# EAGLE design Laser_Control_Board (EAGLE 9.5.2)
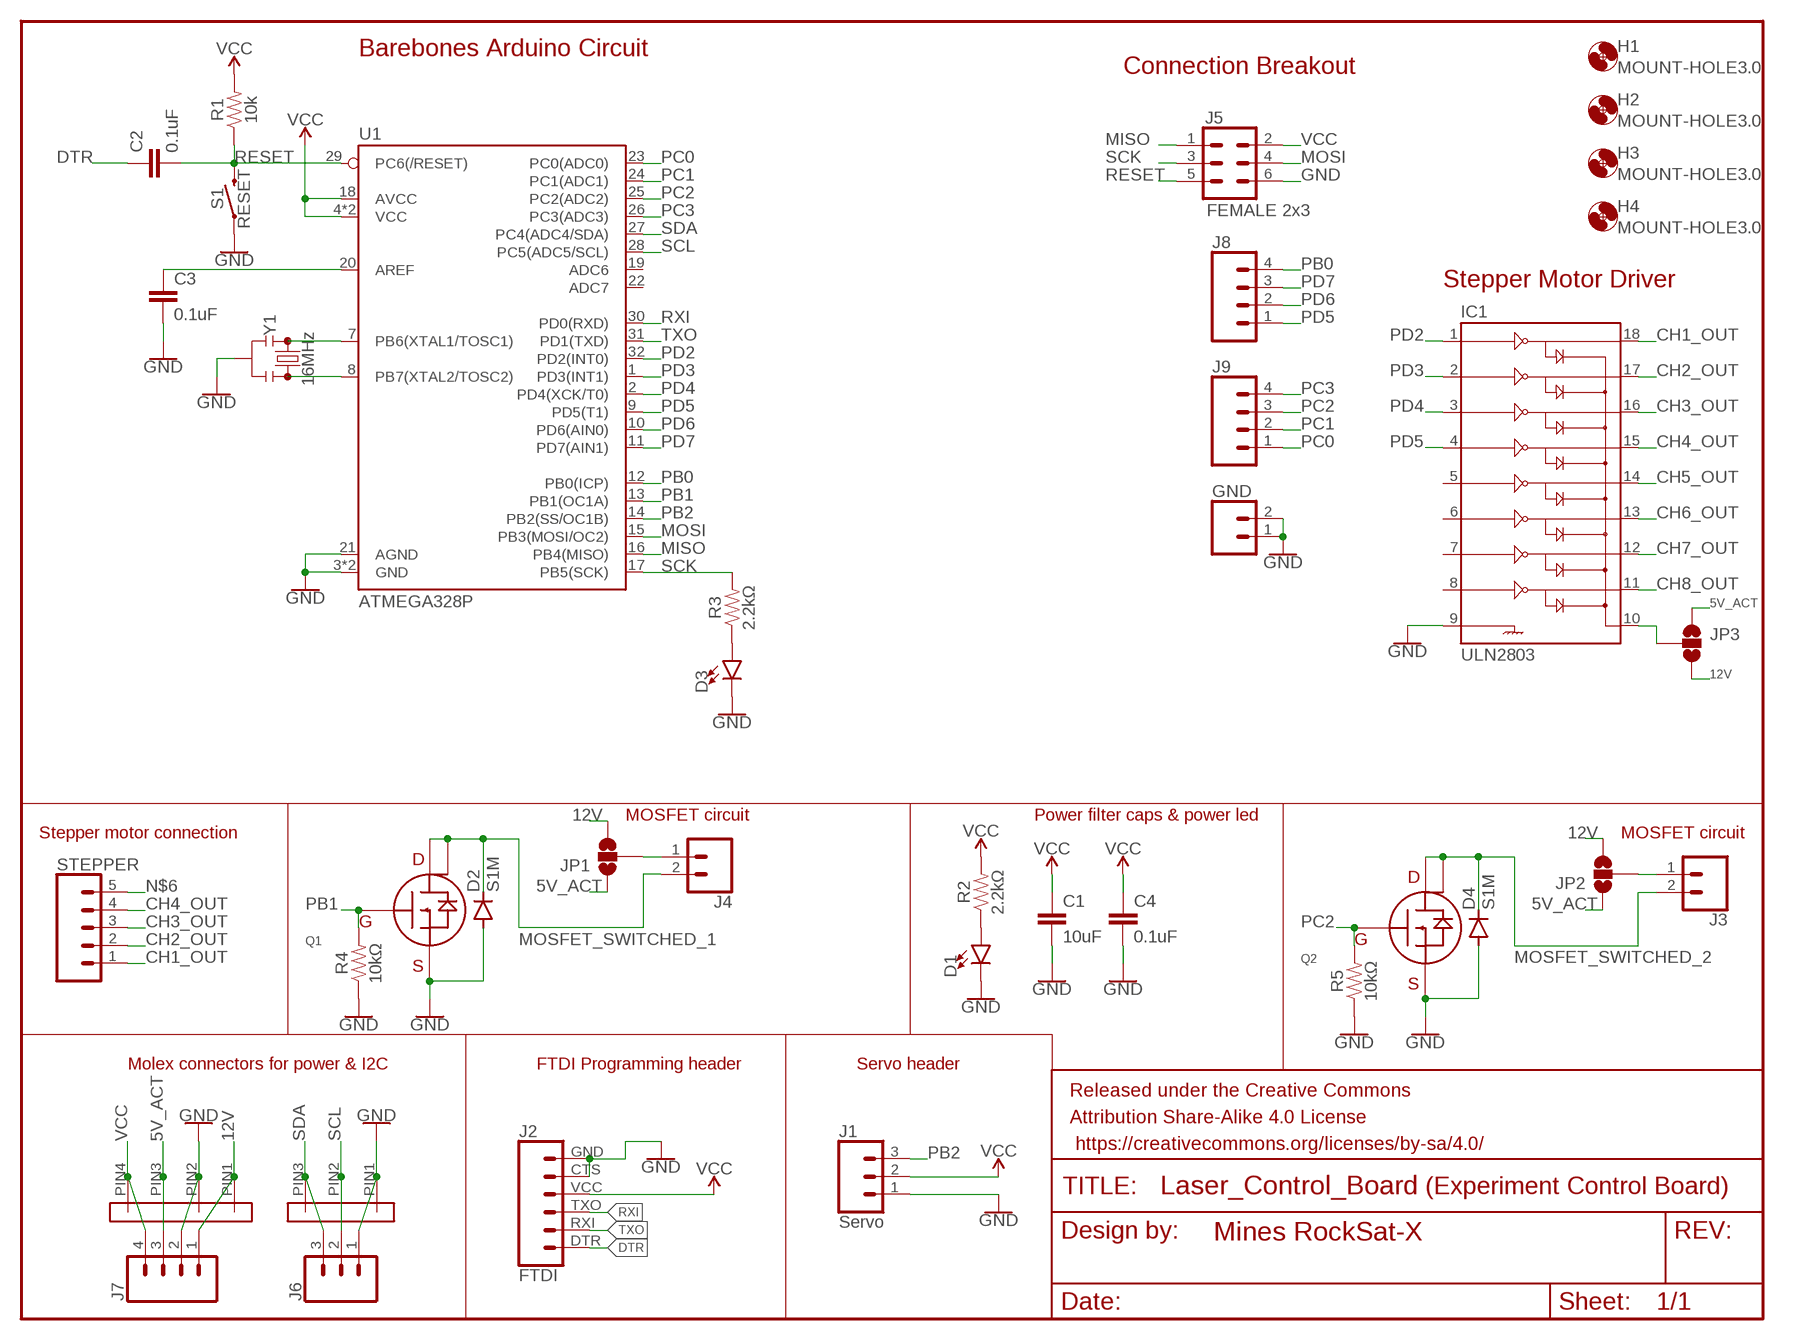
[diagram p0: schematic, sheet 1]

## Parts
C1  10uF  10UF-0805-10V-10%  [0805]
C2  0.1uF  2.2UF-0805-25V-(+80/-20%)  [0805]
C3  0.1uF  2.2UF-0805-25V-(+80/-20%)  [0805]
C4  0.1uF  2.2UF-0805-25V-(+80/-20%)  [0805]
D1  LED-GREEN1206  [LED-1206]
D2  S1M  [SMA]
D3  LED-GREEN1206  [LED-1206]
D4  S1M  [SMA]
FRAME1  FRAME-LETTERNO_PACKAGE  [DUMMY]
GND  CONN_02LOCK_LONGPADS  [1X02_LOCK_LONGPADS]
H1  MOUNT-HOLE3.0  [3,0]
H2  MOUNT-HOLE3.0  [3,0]
H3  MOUNT-HOLE3.0  [3,0]
H4  MOUNT-HOLE3.0  [3,0]
IC1  ULN2803  ULN2803SOICW  [SO18L]
J1  Servo  CONN_03  [1X03]
J2  FTDI  6_PIN_SERIAL_CABLEPTH  [FTDI_BASIC]
J3  CONN_02  [1X02]
J4  CONN_02  [1X02]
J5  FEMALE 2x3  CONN_03X2FEMALE  [2X3]
J6  CONN_03  [1X03]
J7  CONN_04LOCK  [1X04_LOCK]
J8  CONN_04LOCK  [1X04_LOCK]
J9  CONN_04LOCK  [1X04_LOCK]
JP1  JUMPER-SMT_3_NO_NO_SILK  [SMT-JUMPER_3_0-NO_TRACE_NO-SILK]
JP2  JUMPER-SMT_3_NO_NO_SILK  [SMT-JUMPER_3_0-NO_TRACE_NO-SILK]
JP3  JUMPER-SMT_3_NO_NO_SILK  [SMT-JUMPER_3_0-NO_TRACE_NO-SILK]
Q1  BUK9880-55A  [SOT223]
Q2  BUK9880-55A  [SOT223]
R1  10k  RESISTOR0805  [0805]
R2  2.2kΩ  RESISTOR0805  [0805]
R3  2.2kΩ  RESISTOR0805  [0805]
R4  10kΩ  RESISTOR0805  [0805]
R5  10kΩ  RESISTOR0805  [0805]
S1  RESET  MOMENTARY-SWITCH-SPST-SMD-5.2-REDUNDANT  [TACTILE_SWITCH_SMD_5.2MM]
STEPPER  CONN_05  [1X05]
U1  ATMEGA328P  ATMEGA328P_TQFP  [TQFP32-08]
U$1  MOLEX_4PIN  [MOLEX_4PIN]
U$2  MOLEX_3PIN  [MOLEX_3PIN]
Y1  16MHz  RESONATOR-16MHZSMD_3.2X1.3  [RESONATOR-SMD-3.2X1.3]

## Nets
5V_ACT: J7.3 JP1.1 JP2.1 JP3.1 U$1.PIN3
12V: J7.1 JP1.3 JP2.3 JP3.3 U$1.PIN1
CH1_OUT: IC1.18 STEPPER.1
CH2_OUT: IC1.17 STEPPER.2
CH3_OUT: IC1.16 STEPPER.3
CH4_OUT: IC1.15 STEPPER.4
CH5_OUT: IC1.14
CH6_OUT: IC1.13
CH7_OUT: IC1.12
CH8_OUT: IC1.11
DTR: C2.1 J2.DTR
GND: C1.2 C3.2 C4.2 D1.C D2.A D3.C D4.A GND.1 GND.2 IC1.9 J1.1 J2.CTS J2.GND J5.6 J6.1 J7.2 Q1.3(SOURCE) Q2.3(SOURCE) R4.1 R5.1 S1.1 S1.2 U1.3(GND) U1.5(GND) U1.21(AGND) U$1.PIN2 U$2.PIN1 Y1.2
MISO: J5.1 U1.16(PB4(MISO))
MOSFET_SWITCHED_1: D2.C J4.2 Q1.2(DRAIN) Q1.4(DRAIN_TAB)
MOSFET_SWITCHED_2: D4.C J3.2 Q2.2(DRAIN) Q2.4(DRAIN_TAB)
MOSI: J5.4 U1.15(PB3(MOSI/OC2))
N$1: J4.1 JP1.2
N$2: U1.7(PB6(XTAL1/TOSC1)) Y1.1
N$3: U1.8(PB7(XTAL2/TOSC2)) Y1.3
N$4: C3.1 U1.20(AREF)
N$5: D1.A R2.1
N$6: IC1.10 JP3.2 STEPPER.5
N$7: D3.A R3.1
N$8: J3.1 JP2.2
PB0: J8.4 U1.12(PB0(ICP))
PB1: Q1.1(GATE) R4.2 U1.13(PB1(OC1A))
PB2: J1.3 U1.14(PB2(SS/OC1B))
PC0: J9.1 U1.23(PC0(ADC0))
PC1: J9.2 U1.24(PC1(ADC1))
PC2: J9.3 Q2.1(GATE) R5.2 U1.25(PC2(ADC2))
PC3: J9.4 U1.26(PC3(ADC3))
PD2: IC1.1 U1.32(PD2(INT0))
PD3: IC1.2 U1.1(PD3(INT1))
PD4: IC1.3 U1.2(PD4(XCK/T0))
PD5: IC1.4 J8.1 U1.9(PD5(T1))
PD6: J8.2 U1.10(PD6(AIN0))
PD7: J8.3 U1.11(PD7(AIN1))
RESET: C2.2 J5.5 R1.1 S1.3 S1.4 U1.29(PC6(/RESET))
RXI: J2.TXO U1.30(PD0(RXD))
SCK: J5.3 R3.2 U1.17(PB5(SCK))
SCL: J6.2 U1.28(PC5(ADC5/SCL)) U$2.PIN2
SDA: J6.3 U1.27(PC4(ADC4/SDA)) U$2.PIN3
TXO: J2.RXI U1.31(PD1(TXD))
VCC: C1.1 C4.1 J1.2 J2.VCC J5.2 J7.4 R1.2 R2.2 U1.4(VCC) U1.6(VCC) U1.18(AVCC) U$1.PIN4
Unconnected: IC1.5 IC1.6 IC1.7 IC1.8 U1.19(ADC6) U1.22(ADC7)

## Notes on the sheet
- Barebones Arduino Circuit
- Connection Breakout
- Stepper Motor Driver
- MOSFET circuit | Power filter caps & power led
- Stepper motor connection | MOSFET circuit
- Molex connectors for power & I2C | FTDI Programming header | Servo header
- (Experiment Control Board)

## Library data of the parts
C1 = SparkFun-Capacitors:10UF: 10.0µF ceramic capacitors A capacitor is a passive two-terminal electrical component used to store electrical energy temporarily in an electric field.; PROD_ID: CAP-11330
C2-C4 = SparkFun-Capacitors:2.2UF: 2.2µF ceramic capacitors A capacitor is a passive two-terminal electrical component used to store electrical energy temporarily in an electric field.; PROD_ID: CAP-11624; VALUE: 2.2uF
D1 D3 = SparkFun-LED:LED-GREEN: Green SMD LED Used in manufacturing of various products at SparkFun Packages: 0603 - SMD 0603 package [Product Link] <http://www.futureelectronics.com/en/technologies/semiconductors/optoelectronics/leds/Pages/9894312-LTST-C190GKT.aspx?CrossPart=HSMG-C190&IM=0> LilyPad 1206 - SMD1206 LilyPad package [Product Link] <http://www.futureelectronics.com/en/Technologies/Product.aspx?ProductID=IN150NGHARVATEKCORPORATION2049943&IM=0> 1206 - SMD1206 package [Product Link] <http://www.futureelectronics.com/en/technologies/semiconductors/optoelectronics/leds/Pages/8315665-LTST-C150KGKT.aspx?IM=0> 1206 Bottom Mount -SMD 1206 Bottom Mount [Product Link] <http://www.digikey.com/product-detail/en/lite-on-inc/LTST-C230KGKT/160-1456-1-ND/386854> SparkFun Products: Pro Mini 328 -5V <https://www.sparkfun.com/products/821> RedBoard <https://www.sparkfun.com/products/12757> MP3 Trigger <https://www.sparkfun.com/products/13720> Makey Makey <https://www.sparkfun.com/products/11076>; PROD_ID: DIO-00862; VALUE: GREEN
D2 D4 = diode:S1M
FRAME1 = SparkFun-Aesthetics:FRAME-LETTER: Schematic Frame - Letter Standard 8.5x11 US Letter frame; DESIGNER: Mines RockSat-X; VERSION: 1
GND J3 J4 = SparkFun-Connectors:CONN_02: Multi connection point. Often used as Generic Header-pin footprint for 0.1 inch spaced/style header connections On any of the 0.1 inch spaced packages, you can populate with these: Break Away Headers - Straight <https://www.sparkfun.com/products/116> (PRT-00116) Break Away Male Headers - Right Angle <https://www.sparkfun.com/products/553> (PRT-00553) Female Headers <https://www.sparkfun.com/products/115> (PRT-00115) Break Away Headers - Machine Pin <https://www.sparkfun.com/products/117> (PRT-00117) Break Away Female Headers - Swiss Machine Pin <https://www.sparkfun.com/products/743> (PRT-00743) For SCREWTERMINALS and SPRING TERMINALS visit here: Screw Terimnals on SparkFun.com <https://www.sparkfun.com/search/results?term=Screw+Terminals> (5mm/3.5mm/2.54mm spacing) This device is also useful as a general connection point to wire up your design to another part of your project. Our various solder wires solder well into these plated through hole pads. Hook-Up Wire - Assortment (Stranded, 22 AWG) <https://www.sparkfun.com/products/11375> (PRT-11375) Hook-Up Wire - Assortment (Solid Core, 22 AWG) <https://www.sparkfun.com/products/11367> (PRT-11367) View the entire wire category on our website here <https://www.sparkfun.com/categories/141> Special notes: Molex polarized connector foot print use with: PRT-08233 with associated crimp pins and housings. 2.54_SCREWTERM for use with PRT-10571. 3.5mm Screw Terminal footprints for PRT-08084 5mm Screw Terminal footprints for use with PRT-08432
H1-H4 = holes:MOUNT-HOLE: MOUNTING HOLE with drill center marker
IC1 = SparkFun-IC-Special-Function:ULN2803: Darlington Driver(IC-07959, low stock) ULN2803 Darlington array. 500mA max per channel, 8-channel package. Spark Fun Electronics SKU : COM-00312
J1 J6 = SparkFun-Connectors:CONN_03: Multi connection point. Often used as Generic Header-pin footprint for 0.1 inch spaced/style header connections On any of the 0.1 inch spaced packages, you can populate with these: Break Away Headers - Straight <https://www.sparkfun.com/products/116> (PRT-00116) Break Away Male Headers - Right Angle <https://www.sparkfun.com/products/553> (PRT-00553) Female Headers <https://www.sparkfun.com/products/115> (PRT-00115) Break Away Headers - Machine Pin <https://www.sparkfun.com/products/117> (PRT-00117) Break Away Female Headers - Swiss Machine Pin <https://www.sparkfun.com/products/743> (PRT-00743) Stackable Header - 3 Pin (Female, 0.1") <https://www.sparkfun.com/products/13875> (PRT-13875) For SCREWTERMINALS and SPRING TERMINALS visit here: Screw Terimnals on SparkFun.com <https://www.sparkfun.com/search/results?term=Screw+Terminals> (5mm/3.5mm/2.54mm spacing) This device is also useful as a general connection point to wire up your design to another part of your project. Our various solder wires solder well into these plated through hole pads. Hook-Up Wire - Assortment (Stranded, 22 AWG) <https://www.sparkfun.com/products/11375> (PRT-11375) Hook-Up Wire - Assortment (Solid Core, 22 AWG) <https://www.sparkfun.com/products/11367> (PRT-11367) View the entire wire category on our website here <https://www.sparkfun.com/categories/141> Special notes: Molex polarized connector foot print use with SKU : PRT-08232 with associated crimp pins and housings.; PROD_ID: XXX-00000; VALUE: 455-1750-1-ND
J2 = SparkFun-Connectors:6_PIN_SERIAL_CABLE: 6-pin header connection for use with the "FTDI BASIC" pinout - CABLE SIDE. Also known as "Arduino Serial Program Header". This is used on a design to provide a 6-pin connection point for serial communication usually from a USB cable (D+/D-) to these headers (RX/TX). It also has the remaining pins necessary for programming in the Arduino evironment (DTR, GND, and sometimes VCC). Note, this device has "CABLE" in the name. It is intended to be used on a design that usually lives on the end of your USB cable and prvides the converter chip (FTDI232 or FTDI231x) to commnicate serial RX/TX. The "sister" device, named "TARGET" is inteneded to be used on a design that contains a target micro-controller that you wish to program. You can populate with some of these: Female Headers <https://www.sparkfun.com/products/115> (PRT-00115) For reference (or to suit your programming needs) check out these designs: SparkFun FTDI Basic Breakout - 5V <https://www.sparkfun.com/products/9716> (DEV-09716) SparkFun FTDI Basic Breakout - 3.3V <https://www.sparkfun.com/products/9873> (DEV-09873) SparkFun FTDI SmartBasic <https://www.sparkfun.com/products/12935> (DEV-12935) SparkFun Beefy 3 - FTDI Basic Breakout <https://www.sparkfun.com/products/13746> (DEV-13746)
J5 = SparkFun-Connectors:CONN_03X2: Multi connection point. Often used as Generic Header-pin footprint for 0.1 inch spaced/style header connections You can populate with any combo of single row headers, but if you'd like an exact match, check these: Header - 2x3 (Male, 0.1") <https://www.sparkfun.com/products/12807> (PRT-12807) Header - 2x3 (Female, 0.1") <https://www.sparkfun.com/products/13010> (PRT-13010) 2x3 Pin Shrouded Header <https://www.sparkfun.com/products/10877> (PRT-10877) On any of the 0.1 inch spaced packages, you can populate with these: Break Away Headers - Straight <https://www.sparkfun.com/products/116> (PRT-00116) Break Away Male Headers - Right Angle <https://www.sparkfun.com/products/553> (PRT-00553) Female Headers <https://www.sparkfun.com/products/115> (PRT-00115) Break Away Headers - Machine Pin <https://www.sparkfun.com/products/117> (PRT-00117) Break Away Female Headers - Swiss Machine Pin <https://www.sparkfun.com/products/743> (PRT-00743) Special note: the shrouded connector mates well with our 3x2 ribbon cables: Ribbon Crimp Connector - 6-pin (2x3, Female) <https://www.sparkfun.com/products/10651> (PRT-10651) Ribbon Cable - 6 wire (15ft) <https://www.sparkfun.com/products/10646> (PRT-10646); PROD_ID: CONN-11566
J7-J9 = SparkFun-Connectors:CONN_04: Multi connection point. Often used as Generic Header-pin footprint for 0.1 inch spaced/style header connections On any of the 0.1 inch spaced packages, you can populate with these: Break Away Headers - Straight <https://www.sparkfun.com/products/116> (PRT-00116) Break Away Male Headers - Right Angle <https://www.sparkfun.com/products/553> (PRT-00553) Female Headers <https://www.sparkfun.com/products/115> (PRT-00115) Break Away Headers - Machine Pin <https://www.sparkfun.com/products/117> (PRT-00117) Break Away Female Headers - Swiss Machine Pin <https://www.sparkfun.com/products/743> (PRT-00743) For SCREWTERMINALS and SPRING TERMINALS visit here: Screw Terimnals on SparkFun.com <https://www.sparkfun.com/search/results?term=Screw+Terminals> (5mm/3.5mm/2.54mm spacing) This device is also useful as a general connection point to wire up your design to another part of your project. Our various solder wires solder well into these plated through hole pads. Hook-Up Wire - Assortment (Stranded, 22 AWG) <https://www.sparkfun.com/products/11375> (PRT-11375) Hook-Up Wire - Assortment (Solid Core, 22 AWG) <https://www.sparkfun.com/products/11367> (PRT-11367) View the entire wire category on our website here <https://www.sparkfun.com/categories/141> Special notes: Molex polarized connector foot print use with SKU : PRT-08231 with associated crimp pins and housings. 1MM SMD Version SKU: PRT-10208; PROD_ID: CONN-09696
JP1-JP3 = SparkFun-Jumpers:JUMPER-SMT_3_NO: Normally open jumper This jumper has three pads in close proximity to each other. Apply solder to close the connection(s).
Q1 Q2 = PowerManagementParts:BUK9880-55A
R1-R5 = SparkFun-Resistors:RESISTOR: Generic Resistor Package
S1 = SparkFun-Switches:MOMENTARY-SWITCH-SPST: Momentary Switch (Pushbutton) - SPST Normally-open (NO) SPST momentary switches (buttons, pushbuttons). Variants PTH-12MM - 12mm square, through-hole Momentary Pushbutton Switch - 12mm Square <https://www.sparkfun.com/products/9190> (COM-09190) PTH-6.0MM, PTH-6.0MM-KIT - 6.0mm square, through-hole Mini Pushbutton Switch <https://www.sparkfun.com/products/97> (COM-00097) KIT package intended for soldering kit's - only one side of pads' copper is exposed. PTH-RIGHT-ANGLE-KIT - Right-angle, through-hole Right Angle Tactile Button <https://www.sparkfun.com/products/10791> - Used on SparkFun BigTime Watch Kit <https://www.sparkfun.com/products/11734> SMD-12MM - 12mm square, surface-mount Tactile Button - SMD (12mm) <https://www.sparkfun.com/products/12993> (COM-12993) Used on SparkFun PicoBoard <https://www.sparkfun.com/products/11888> SMD-4.5MM - 4.5mm Square Trackball Switch Used on SparkFun Blackberry Trackballer Breakout <https://www.sparkfun.com/products/13169> SMD-4.6MMX2.8MM - 4.60mm x 2.80mm, surface mount Used on SparkFun SAMD21 Mini Breakout <https://www.sparkfun.com/products/13664> SMD-5.2MM, SMD-5.2-REDUNDANT - 5.2mm square, surface-mount Mini Pushbutton Switch - SMD <https://www.sparkfun.com/products/8720> (COM-08720) Used on Arduino Pro Mini <https://www.sparkfun.com/products/11114> REDUNDANT package connects both switch circuits together SMD-6.0X3.5MM - 6.0 x 3.5mm, surface mount Momentary Reset Switch SMD <https://www.sparkfun.com/products/8229> (COM-08229) SMD-6.2MM-TALL - 6.2mm square, surface mount Tactile Button - SMD (6mm) <https://www.sparkfun.com/products/12992> Used on SparkFun Digital Sandbox <https://www.sparkfun.com/products/12651> SMD-RIGHT-ANGLE - Right-angle, surface mount Used on SparkFun Block for Intel® Edison - Arduino <https://www.sparkfun.com/products/13036>; PROD_ID: SWCH-08247; SF_SKU: COM-08720
STEPPER = SparkFun-Connectors:CONN_05: Multi connection point. Often used as Generic Header-pin footprint for 0.1 inch spaced/style header connections On any of the 0.1 inch spaced packages, you can populate with these: Break Away Headers - Straight <https://www.sparkfun.com/products/116> (PRT-00116) Break Away Male Headers - Right Angle <https://www.sparkfun.com/products/553> (PRT-00553) Female Headers <https://www.sparkfun.com/products/115> (PRT-00115) Break Away Headers - Machine Pin <https://www.sparkfun.com/products/117> (PRT-00117) Break Away Female Headers - Swiss Machine Pin <https://www.sparkfun.com/products/743> (PRT-00743) For SCREWTERMINALS and SPRING TERMINALS visit here: Screw Terimnals on SparkFun.com <https://www.sparkfun.com/search/results?term=Screw+Terminals> (5mm/3.5mm/2.54mm spacing) This device is also useful as a general connection point to wire up your design to another part of your project. Our various solder wires solder well into these plated through hole pads. Hook-Up Wire - Assortment (Stranded, 22 AWG) <https://www.sparkfun.com/products/11375> (PRT-11375) Hook-Up Wire - Assortment (Solid Core, 22 AWG) <https://www.sparkfun.com/products/11367> (PRT-11367) View the entire wire category on our website here <https://www.sparkfun.com/categories/141> Special notes: Molex polarized connector foot print use with SKU : PRT-08231 with associated crimp pins and housings. 1MM SMD Version SKU: PRT-10208
U1 = SparkFun-IC-Microcontroller:ATMEGA328P_TQFP: Popular 328P in QFP Storefront component: ATmega328 - TQFP <https://www.sparkfun.com/products/13448> (COM-13448) Datasheet <http://www.sparkfun.com/datasheets/Components/SMD/ATMega328.pdf> SparkFun Products SparkFun RedBoard - Programmed with Arduino <https://www.sparkfun.com/products/12757> (DEV-12757) Arduino Pro Mini 328 - 5V/16MHz <https://www.sparkfun.com/products/11113> (DEV-11113) Arduino Pro Mini 328 - 3.3V/8MHz <https://www.sparkfun.com/products/11114> (DEV-11114) SparkFun OpenLog <https://www.sparkfun.com/products/13712> (DEV-13712) SparkFun MicroView - OLED Arduino Module <https://www.sparkfun.com/products/12923> (DEV-12923) SparkFun Digital Sandbox <https://www.sparkfun.com/products/12651> (DEV-12651) SparkFun PicoBoard <https://www.sparkfun.com/products/11888> (WIG-11888) Arduino Fio <https://www.sparkfun.com/products/10116> (DEV-10116) LilyPad Arduino 328 Main Board <https://www.sparkfun.com/products/13342> (DEV-13342) SparkFun RedStick <https://www.sparkfun.com/products/13741> (DEV-13741) LilyPad MP3 <https://www.sparkfun.com/products/11013> (DEV-11013) LilyPad Arduino SimpleSnap <https://www.sparkfun.com/products/10941> (DEV-10941) SparkFun Stepoko <https://www.sparkfun.com/products/13899> (ROB-13899) SparkFun Geiger Counter <https://www.sparkfun.com/products/11345> (SEN-11345) SparkFun EL Sequencer <https://www.sparkfun.com/products/12781> (COM-12781) Arduino Pro 328 - 5V/16MHz <https://www.sparkfun.com/products/10915> (DEV-10915) CryptoCape <https://www.sparkfun.com/products/12773> (DEV-12773) SparkFun IR Thermometer Evaluation Board - MLX90614 <https://www.sparkfun.com/products/10740> (SEN-10740) SparkFun RedBot Mainboard <https://www.sparkfun.com/products/12097> (ROB-12097) Arduino Pro 328 - 3.3V/8MHz <https://www.sparkfun.com/products/10914> (DEV-10914) SparkFun Block for Intel® Edison - Arduino <https://www.sparkfun.com/products/13036> (DEV-13036) SparkFun Simon Says - Surface Mount Soldering Kit <https://www.sparkfun.com/products/10935> (KIT-10935) SparkFun 7-Segment Serial Display - Red <https://www.sparkfun.com/products/11441> (COM-11441) SparkFun 7-Segment Serial Display - White <https://www.sparkfun.com/products/11629> (COM-11629) SparkFun 7-Segment Serial Display - Yellow <https://www.sparkfun.com/products/11443> (COM-11443) SparkFun 7-Segment Serial Display - Kelly Green <https://www.sparkfun.com/products/11440> (COM-11440) SparkFun 7-Segment Serial Display - Blue <https://www.sparkfun.com/products/11442> (COM-11442) SparkFun OpenSegment Serial Display - 20mm (Blue) <https://www.sparkfun.com/products/11647> (COM-11647) SparkFun OpenSegment Serial Display - 20mm (Green) <https://www.sparkfun.com/products/11646> (COM-11646) SparkFun OpenSegment Serial Display - 20mm (White) <https://www.sparkfun.com/products/11648> (COM-11648) SparkFun OpenSegment Serial Display - 20mm (Red) <https://www.sparkfun.com/products/11644> (COM-11644) SparkFun OpenSegment Serial Display - 20mm (Yellow) <https://www.sparkfun.com/products/11645> (COM-11645) SparkFun OpenSegment Shield <https://www.sparkfun.com/products/13190> (DEV-13190); PROD_ID: IC-09069; VALUE: ATMEGA328P_TQFP
U$1 = PowerManagementParts:MOLEX_4PIN
U$2 = PowerManagementParts:MOLEX_3PIN
Y1 = SparkFun-Clocks:RESONATOR-16MHZ: 16MHz Resonator Digikey Example <http://www.digikey.com/product-detail/en/murata-electronics-north-america/CSTCE16M0V53-R0/490-1198-1-ND/584635> Frequency: 16MHz Frequency Stability: ±0.3% Frequency Tolerance: ±0.5% Capacitance: 15pF SparkFun Products SparkFun OpenLog <https://www.sparkfun.com/products/13712> SparkFun MicroView - OLED Arduino Module <https://www.sparkfun.com/products/12923>; PROD_ID: XTAL-08900

## Board
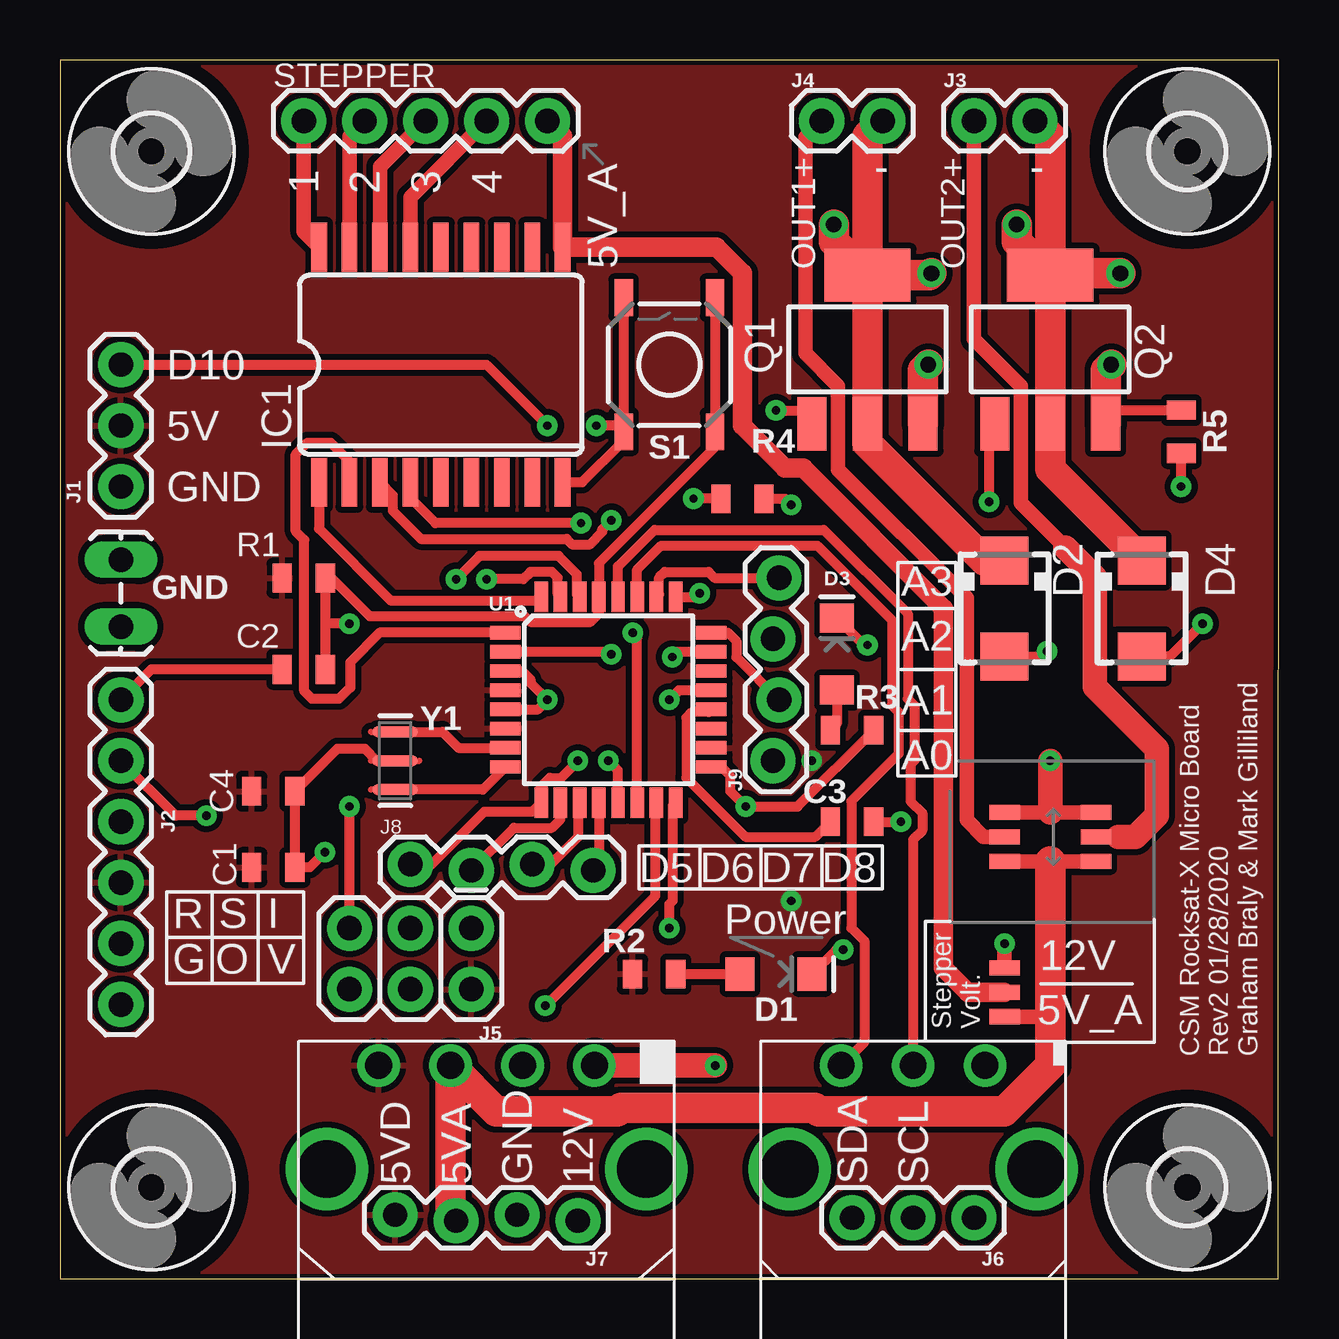
[diagram p1: board, top side]
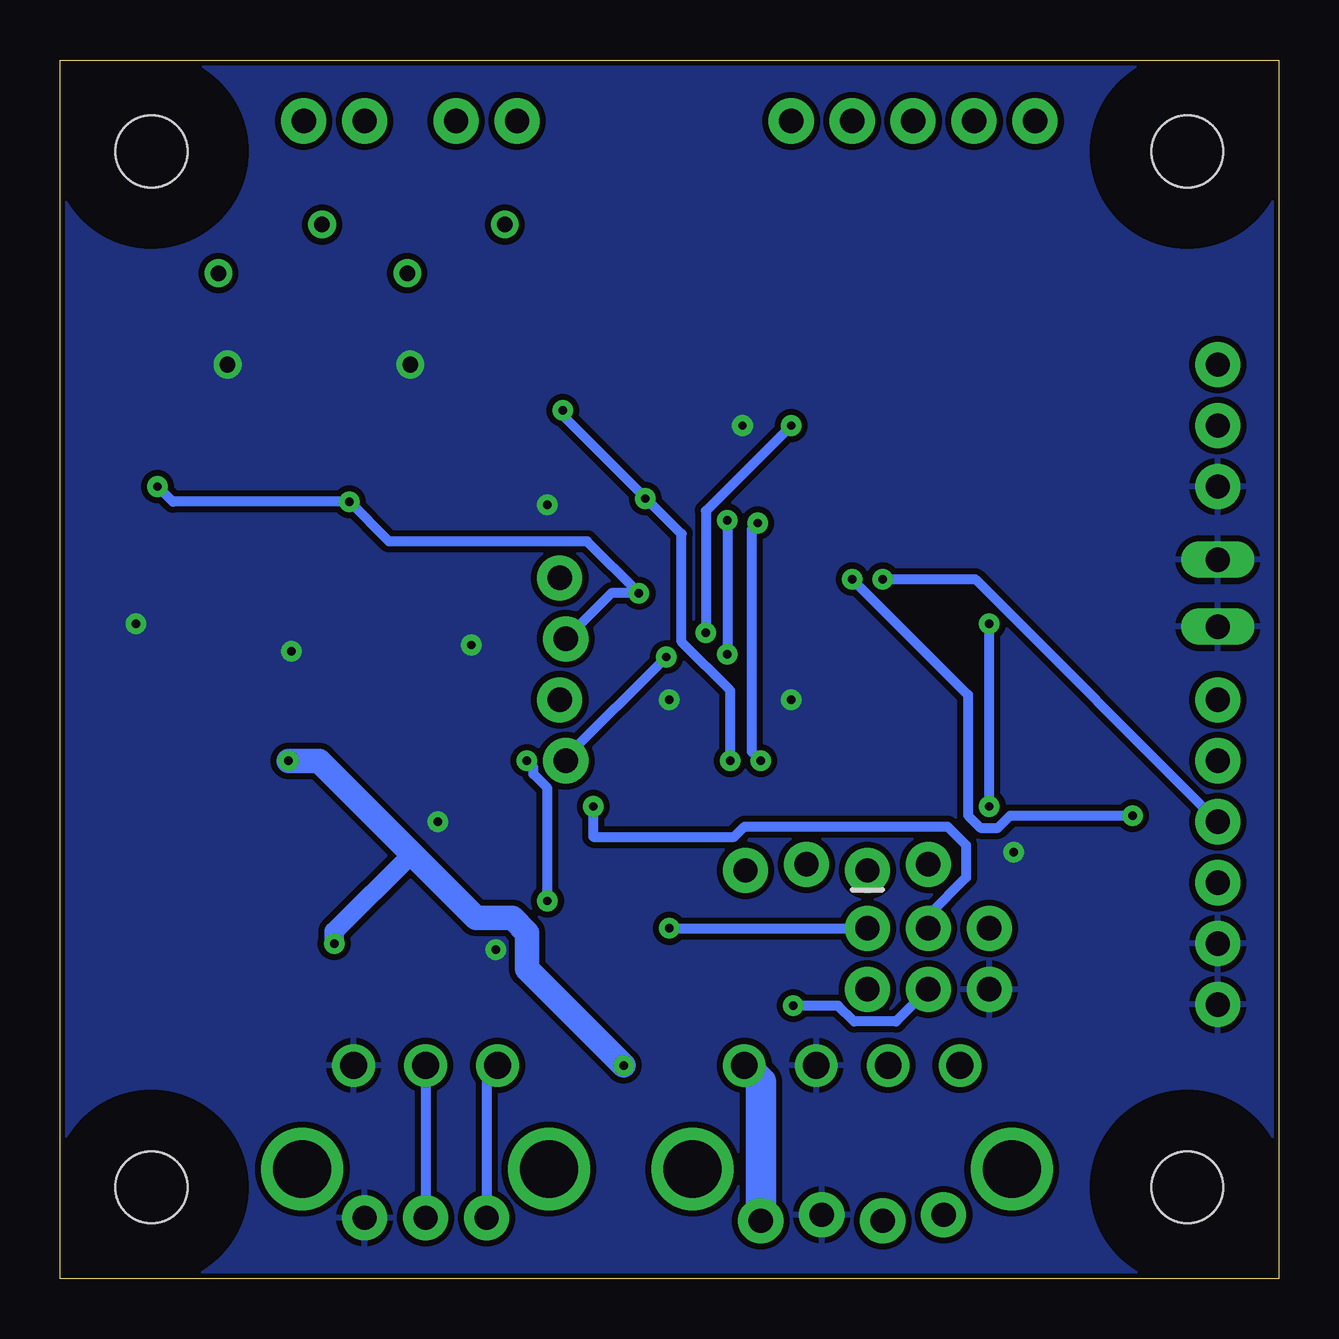
[diagram p2: board, bottom side, seen from below]

Size 50.8 x 50.8 mm. Coordinates in mm from the lower left corner, seen from the top.
Outline: 0,0 50.78,0 50.8,50.8 0,50.8 0,0
Copper layers (1*16): Top 0.035mm / dielectric 1.5mm / Bottom 0.035mm
Design rules "SparkFun-2-layer-STANDARD_13milDrill": minimum track width 10mil, minimum drill 13mil, track to track 10mil, track to pad 8mil, pad to pad 8mil, via to via 10mil, smd to smd 8mil, copper to edge 8mil, drill to drill 8mil, minimum pad ring 10mil, minimum via ring 10mil, stop-mask expansion 4mil, vias tented up to drill 25mil, thermal gap 10mil

### Footprints (pad centres in the part's own frame; a part is rotated, then mirrored left to right if it is on the bottom)
0805 = smd 0.8 x 1.2: 1 -0.9,0; 2 0.9,0
LED-1206 = smd 1.2 x 1.4: A -1.5,0; C 1.5,0
SMA = smd 2 x 2: A 2,0; C -2,0
1X02_LOCK_LONGPADS = drill 1.016 long: 1 -0.127,0; 2 2.667,0
3,0 = hole 3: 0,0
SO18L = smd 0.66 x 2.032: 1 -0.635,-4.902; 2 0.635,-4.902; 3 1.905,-4.902; 4 3.175,-4.902; 5 4.445,-4.902; 6 5.715,-4.902; 7 6.985,-4.902; 8 8.255,-4.902; 9 9.525,-4.902; 10 9.525,4.902; 11 8.255,4.902; 12 6.985,4.902; 13 5.715,4.902; 14 4.445,4.902; 15 3.175,4.902; 16 1.905,4.902; 17 0.635,4.902; 18 -0.635,4.902
1X03 = drill 1.016 pad 1.88: 1 0,0; 2 2.54,0; 3 5.08,0
FTDI_BASIC = drill 1.016 pad 1.88: CTS 10.16,0; DTR 0,0; GND 12.7,0; RXI 2.54,0; TXO 5.08,0; VCC 7.62,0
1X02 = drill 1.016 pad 1.88: 1 0,0; 2 2.54,0
2X3 = drill 1.016 pad 1.88: 1 0,0; 2 0,2.54; 3 2.54,0; 4 2.54,2.54; 5 5.08,0; 6 5.08,2.54
1X04_LOCK = drill 1.016 pad 1.88: 1 0,0.127; 2 2.54,-0.127; 3 5.08,0.127; 4 7.62,-0.127
SMT-JUMPER_3_0-NO_TRACE_NO-SILK = smd 0.635 x 1.27: 1 -1.016,0; 2 0,0; 3 1.016,0
SOT223 = smd 1.219 x 2.235: 1 -2.311,-3.099; 2 0,-3.099; 3 2.311,-3.099 | smd 3.6 x 2.2: 4 0,3.099
TACTILE_SWITCH_SMD_5.2MM = smd 1.524 x 0.762: 1 -2.794,1.905; 2 2.794,1.905; 3 -2.794,-1.905; 4 2.794,-1.905
1X05 = drill 1.016 pad 1.88: 1 0,0; 2 2.54,0; 3 5.08,0; 4 7.62,0; 5 10.16,0
TQFP32-08 = smd 1.27 x 0.559: 1 -4.293,2.8; 2 -4.293,2; 3 -4.293,1.2; 4 -4.293,0.4; 5 -4.293,-0.4; 6 -4.293,-1.2; 7 -4.293,-2; 8 -4.293,-2.8; 17 4.293,-2.8; 18 4.293,-2; 19 4.293,-1.2; 20 4.293,-0.4; 21 4.293,0.4; 22 4.293,1.2; 23 4.293,2; 24 4.293,2.8 | smd 0.559 x 1.27: 9 -2.8,-4.293; 10 -2,-4.293; 11 -1.2,-4.293; 12 -0.4,-4.293; 13 0.4,-4.293; 14 1.2,-4.293; 15 2,-4.293; 16 2.8,-4.293; 25 2.8,4.293; 26 2,4.293; 27 1.2,4.293; 28 0.4,4.293; 29 -0.4,4.293; 30 -1.2,4.293; 31 -2,4.293; 32 -2.8,4.293
MOLEX_4PIN = drill 2.413: MH1 -6.655,-4.318; MH2 6.655,-4.318 | drill 1.118 pad 1.778: PIN1 4.496,0; PIN2 1.499,0; PIN3 -1.499,0; PIN4 -4.496,0
MOLEX_3PIN = drill 2.413: MH1 -5.144,-4.318; MH2 5.144,-4.318 | drill 1.118 pad 1.778: PIN1 2.997,0; PIN2 0,0; PIN3 -2.997,0
RESONATOR-SMD-3.2X1.3 = smd 0.45 x 1.905: 1 -1.2,0; 2 0,0; 3 1.2,0

### Placement (x,y rotation side)
C1  8.89,17.14 0 top
C2  10.16,25.4 0 top
C3  33.02,19.05 0 top
C4  8.89,20.32 0 top
D1  29.84,12.7 0 top
D2  39.37,27.94 270 top
D3  32.38,26.04 90 top
D4  45.09,27.94 270 top
FRAME1  0,0 0 top
GND  2.54,27.3 90 top
H1  3.81,3.81 0 top
H2  46.99,3.81 0 top
H3  3.81,46.99 0 top
H4  46.99,46.99 0 top
IC1  11.43,38.1 0 top
J1  2.54,33.02 90 top
J2  2.54,24.13 270 top
J3  38.1,48.26 0 top
J4  31.75,48.26 0 top
J5  17.14,14.61 180 top
J6  38.1,2.54 180 top
J7  21.59,2.54 180 top
J8  14.61,17.14 0 top
J9  29.84,21.59 90 top
JP1  39.37,18.41 90 top
JP2  43.18,18.41 90 top
JP3  39.37,11.94 90 top
Q1  33.66,38.73 0 top
Q2  41.27,38.73 0 top
R1  10.16,29.21 180 top
R2  24.77,12.7 180 top
R3  33.02,22.86 0 top
R4  28.45,32.51 180 top
R5  46.74,35.31 270 top
S1  25.4,38.1 90 top
STEPPER  10.16,48.26 0 top
U1  22.86,24.13 0 top
U$1  17.78,8.89 0 top
U$2  35.56,8.89 0 top
Y1  13.97,21.59 270 top

### Tracks (layer width: path | path; a pad name or v marks a point on that pad's centre or on a via)
5V_ACT
  Top 0.61: JP1.1 41.27,17.4 JP2.1 | JP3.1 41.27,10.92
  Top 1.27: 41.27,17.4 41.27,10.92 41.27,8.89 39.37,6.99 31.61,6.99 31.47,7.12 23.38,7.12 23.24,6.99 18.19,6.99 U$1.PIN3 16.28,2.64 J7.3
12V  (via drill 0.35)
  Top 0.61: JP1.3 41.27,19.43 JP2.3 | JP3.3 v39.37,13.97
  Top 1.016: U$1.PIN1 v27.3,8.89 | v41.27,21.59 41.27,19.43
  Bottom 0.813: 36.13,17.72 39.37,14.48 v39.37,13.97
  Bottom 1.016: v41.27,21.59 40.01,21.59 36.13,17.72 33.45,15.03 31.94,15.03 31.32,14.41 31.32,12.91 v27.3,8.89
  Bottom 1.27: J7.1 21.59,8.2 U$1.PIN1
CH1_OUT
  Top 0.61: IC1.18 10.16,43.64 STEPPER.1
CH2_OUT
  Top 0.61: IC1.17 12.06,47.62 STEPPER.2
CH3_OUT
  Top 0.61: IC1.16 13.34,46.35 STEPPER.3
CH4_OUT
  Top 0.61: IC1.15 14.61,45.09 STEPPER.4
DTR
  Top 0.406: C2.1 3.81,25.4 J2.DTR
GND  (via drill 0.35, 0.65)
  Top 0.406: v11.05,17.78 10.41,17.14 C1.2 C4.2 11.57,22.1 12.7,22.1 13.21,21.59 Y1.2 | D1.C 32.36,13.72 v32.64,13.72 | C3.2 v35.05,19.05 | v25.4,24.13 25.8,24.53 U1.21 | U1.5 19.92,23.73 v20.32,24.13 19.61,24.84 19.61,24.98 19.26,25.33 U1.3 | S1.2 S1.1 | D2.A 40.93,25.94 v41.15,26.16 | v47.62,27.3 46.26,25.94 D4.A | D3.C 33.5,26.42 v33.66,26.42 | S1.1 23.24,35.56 v22.35,35.56 | IC1.9 21.77,33.2 23.5,34.92 S1.1 | R4.1 30.23,32.51 v30.48,32.26 | Q2.3 44.16,36.21 R5.1
  Top 1.27: Q1.3 35.97,37.87 v36.2,38.1 | Q2.3 43.59,37.87 v43.81,38.1
  pour Bottom: 0,0 50.8,0 50.8,50.8 0,50.8
MISO  (via drill 0.35)
  Top 0.406: v25.4,14.61 25.4,15.61 25.55,15.76 25.55,19.72 U1.16
  Bottom 0.406: v25.4,14.61 J5.1
MOSFET_SWITCHED_1  (via drill 0.65)
  Top 0.61: 39.25,29.94 D2.C
  Top 1.27: Q1.4 Q1.2 33.66,34.82 38.53,29.94 39.25,29.94 | Q1.4 33.66,47.62 J4.2 | Q1.4 36.25,41.83 v36.32,41.91 | Q1.4 32.26,43.23 v32.26,43.94
MOSFET_SWITCHED_2  (via drill 0.65)
  Top 1.27: Q2.4 Q2.2 41.27,33.75 D4.C | Q2.4 41.27,47.62 J3.2 | Q2.4 41.35,41.91 v44.2,41.91 | Q2.4 39.88,43.23 v39.88,43.94
MOSI  (via drill 0.35)
  Top 0.406: U1.15 24.86,19.32 24.82,19.28 24.82,15.97 v20.23,11.38
  Bottom 0.406: v20.23,11.38 18.36,11.38 17.7,10.72 15.95,10.72 J5.4
N$1
  Top 0.61: J4.1 31.06,47.57 31.06,38.58 32.44,37.21 32.44,33.72 37.79,28.36 37.79,19.12 38.5,18.41 JP1.2
N$2
  Top 0.406: Y1.1 15.95,22.79 16.61,22.13 U1.7
N$3
  Top 0.406: U1.8 17.63,20.39 Y1.3
N$4
  Top 0.406: C3.1 31.48,18.41 28.58,18.41 26.11,20.88 26.11,23.38 26.35,23.62 27.04,23.62 U1.20
N$5
  Top 0.406: R2.1 D1.A
N$6
  Top 0.813: JP3.2 37.85,11.94 36.83,12.96 36.83,27.94 30.99,33.78 30.23,33.78 28.45,35.56 28.45,41.91 27.36,43 IC1.10 20.95,47.62 STEPPER.5
N$7
  Top 0.406: D3.A 32.38,23.12 R3.1
N$8
  Top 0.406: 44.12,18.41 JP2.2
  Top 0.61: J3.1 38.1,39.16 40.06,37.21 40.06,32.33 41.91,30.48
  Top 1.016: 41.91,30.48 43.15,29.25 43.15,24.66 45.72,22.08 45.72,19.3 44.83,18.41 44.12,18.41
PB0
  Top 0.406: U1.12 22.46,17.25 J8.4
PB1  (via drill 0.35)
  Top 0.406: v29.84,36.2 30.79,36.2 Q1.1 | U1.13 23.26,21.19 v22.86,21.59 | R4.2 v26.42,32.51 v26.41,32.52
  Bottom 0.406: v22.86,21.59 22.86,24.51 24.89,26.54 24.89,31.04 26.39,32.54 | 26.39,32.54 29.84,36 v29.84,36.2 | v26.41,32.52 26.39,32.54
PB2  (via drill 0.35)
  Top 0.406: J1.3 17.78,38.1 v20.32,35.56 | U1.14 24.06,26.74 v23.88,26.92
  Bottom 0.406: v20.32,35.56 23.88,32 v23.88,26.92
PC0  (via drill 0.35)
  Top 0.406: U1.23 25.74,26.13 v25.52,25.91
  Bottom 0.406: v25.52,25.91 29.72,21.72 J9.1
PC1
  Top 0.406: J9.2 28.19,25.91 28.19,26.58 27.84,26.93 U1.24
PC2  (via drill 0.35)
  Top 0.406: U1.25 26.52,28.42 v26.67,28.57 | v38.73,32.38 38.73,35.41 Q2.1 | v46.74,33.02 R5.2
  Bottom 0.406: J9.3 27.81,28.57 v26.67,28.57 28.83,30.73 37.08,30.73 v38.73,32.38 46.1,32.38 v46.74,33.02
PC3
  Top 0.406: U1.26 24.97,28.54 24.97,29.23 25.21,29.46 27.03,29.46 27.29,29.21 J9.4
PD2
  Top 0.406: IC1.1 10.79,31.26 13.78,28.28 19.91,28.28 U1.32
PD3
  Top 0.406: U1.1 13.33,26.93 12.1,25.69 12.1,24.64 11.62,24.16 10.5,24.16 10.18,24.49 10.18,30.8 9.83,31.15 9.83,34.37 10.31,34.85 11.28,34.85 12.14,33.99 12.14,33.27 IC1.2
PD4  (via drill 0.35)
  Top 0.406: v22.98,26.04 22.89,26.13 U1.2 | IC1.3 13.87,32.66 13.87,32.01 15.05,30.84 21.12,30.84 21.35,30.61 22.08,30.61 22.6,31.13 22.6,31.24 v22.99,31.62
  Bottom 0.406: v22.99,31.62 v22.99,26.04 v22.98,26.04
PD5  (via drill 0.35)
  Top 0.406: J8.1 15.49,17.27 17.68,19.46 19.68,19.46 U1.9 20.06,20.53 20.41,20.88 20.88,20.88 v21.59,21.59 | IC1.4 14.61,32.58 14.61,32.55 15.66,31.5 v21.72,31.5
  Bottom 0.406: v21.72,31.5 21.97,31.24 21.97,21.97 v21.59,21.59
PD6
  Top 0.406: J8.2 18.92,18.8 20.51,18.8 20.86,19.15 U1.10
PD7
  Top 0.406: U1.11 21.59,19.77 21.59,18.41 20.45,17.27 J8.3
RESET  (via drill 0.35)
  Top 0.406: 11.06,27.3 R1.1 11.31,29.21 12.91,27.62 19.37,27.62 19.61,27.38 22.11,27.38 22.46,27.73 U1.29 22.46,29.83 27.3,34.67 S1.3 S1.4 | 11.06,27.3 C2.2 | J5.5 v12.06,19.68 | v12.06,27.3 11.06,27.3
  Bottom 0.406: v12.06,19.68 v12.06,27.3
RXI  (via drill 0.35)
  Top 0.406: U1.30 21.55,28.54 21.55,29.36 20.78,30.12 17.49,30.12 16.53,29.16 v16.51,29.16
  Bottom 0.406: v16.51,29.16 12.65,29.16 J2.TXO
SCK  (via drill 0.35)
  Top 0.406: U1.17 27.57,21.33 27.94,20.95 27.94,20.32 v28.57,19.68 30.75,19.68 R3.2
  Bottom 0.406: v28.57,19.68 28.57,18.41 22.7,18.41 22.26,18.85 13.8,18.85 13.03,18.07 13.03,16.73 14.61,15.15 J5.3
SCL
  Top 0.406: U1.28 23.26,29.69 24.79,31.22 31.84,31.22 35.34,27.72 35.34,24.17 35.62,23.89 35.62,21.6 35.45,21.44 35.45,19.9 35.94,19.42 35.94,18.68 35.56,18.3 35.56,17.02 U$2.PIN2
  Bottom 0.406: U$2.PIN2 J6.2
SDA
  Top 0.406: U1.27 24.06,29.56 25.06,30.56 31.57,30.56 34.68,27.45 34.68,23.9 34.95,23.62 34.95,21.88 32.99,19.91 32.99,14.62 33.52,14.08 33.52,9.85 U$2.PIN3
  Bottom 0.406: U$2.PIN3 33.02,8.43 J6.3
TXO  (via drill 0.35)
  Top 0.406: U1.31 20.75,28.54 20.75,29.23 20.51,29.46 19.61,29.46 19.31,29.16 v17.78,29.16 | v6.1,19.3 4.83,19.3 J2.RXI
  Bottom 0.406: v17.78,29.16 12.95,24.33 12.95,19.32 12.43,18.8 11.7,18.8 11.19,19.3 v6.1,19.3
VCC  (via drill 0.35)
  Bottom 0.406: v30.48,15.75 30.48,20.45 31.06,21.03 31.06,21.31 v31.34,21.59
  pour Top: 0,0 50.8,0 50.8,50.8 0,50.8

### Text on the board
tPlace: D10 | 5V | GND | A3 | A2 | A1 | A0 | D5 | D6 | D7 | D8 | R | S | I | G | O | V | 12V | 5V_A | Stepper / Volt. | CSM Rocksat-X Micro Board / Rev2 01/28/2020 / Graham Braly & Mark Gilliland | 5VD | 5VA | GND | 12V | SDA | SCL
tNames: OUT1+ | - | OUT2+ | - | 1 | 2 | 3 | 4 | 5V_A | Power
tDocu: COM | OUT1 | OUT2 | GND